# EAGLE design 701_breakout_serial (EAGLE 7.4.0)
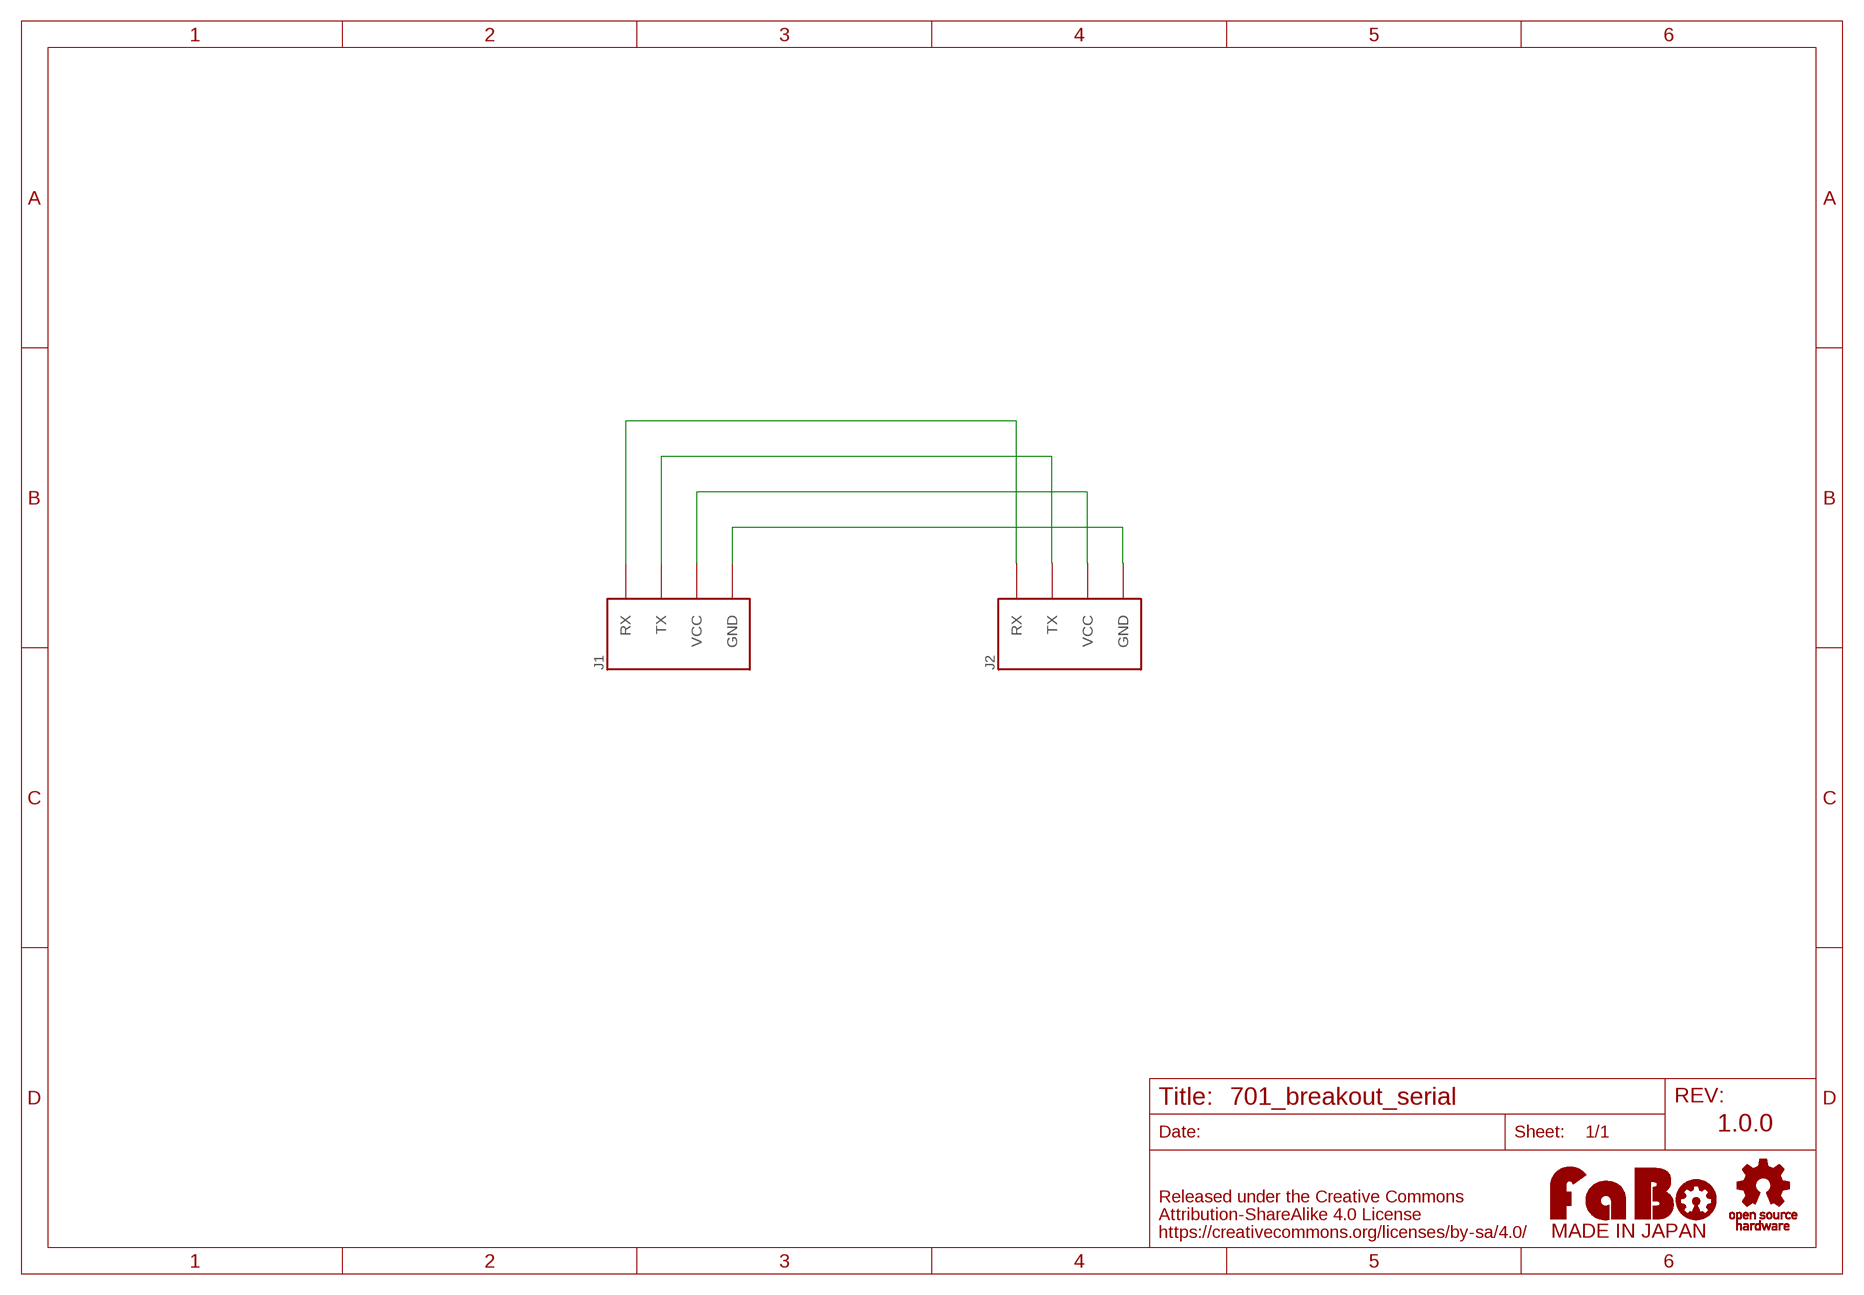
[diagram p0: schematic, sheet 1]

## Parts
J1  FABO_BRICK_SERIAL-BREAKOUT  [FABO_BRICK_SERIAL_BREAKOUT]
J2  FABO_BRICK_SERIAL-CONNECTOR  [FABO_BRICK_SERIAL_CONNECTOR]
U$2  LOGO_FABO-M_BOTTOM  [LOGO_FABO_M_BOTTOM]
U$3  LOGO_OSHW-T_M_BOTTOM  [LOGO_OSHW_T_M_BOTTOM]

## Nets
GND: J1.GND J2.GND
SCL: J1.RX J2.RX
SDA: J1.TX J2.TX
VCC: J1.VCC J2.VCC

## Notes on the sheet
- 1.0.0

## Library data of the parts
J1 J2 = FaBo-Template:FABO_BRICK_SERIAL: FaBo Brick Serial
U$2 = FaBo-etc:LOGO_FABO
U$3 = FaBo-etc:LOGO_OSHW

## Board
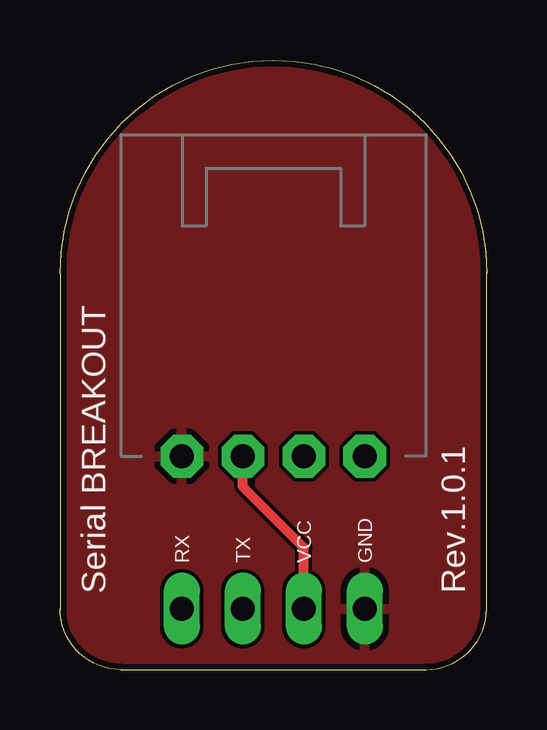
[diagram p1: board, top side]
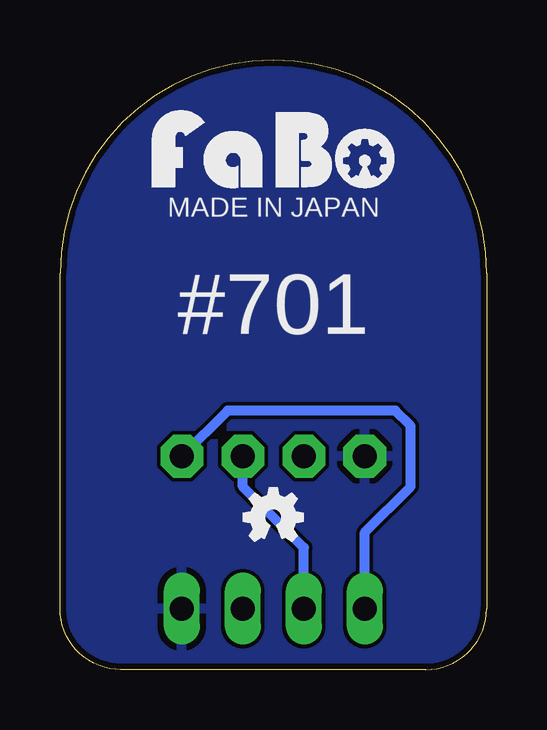
[diagram p2: board, bottom side, seen from below]

Size 17.78 x 25.4 mm. Coordinates in mm from the lower left corner, seen from the top.
Copper layers (1*16): Top 0.035mm / dielectric 1.5mm / Bottom 0.035mm
Design rules "Elecrow_2-layer_eagle_rule": minimum track width 6mil, minimum drill 12mil, track to track 6mil, track to pad 6mil, pad to pad 6mil, via to via 6mil, smd to smd 0mil, copper to edge 10mil, drill to drill 10mil, minimum pad ring 10mil, minimum via ring 6mil, stop-mask expansion 2mil, vias tented up to drill 100mil, thermal gap 10mil

### Footprints (pad centres in the part's own frame; a part is rotated, then mirrored left to right if it is on the bottom)
FABO_BRICK_SERIAL_BREAKOUT = drill 1 long: GND 3.81,-10.16; RX -3.81,-10.16; TX -1.27,-10.16; VCC 1.27,-10.16
FABO_BRICK_SERIAL_CONNECTOR = drill 1 pad 1.778 octagon: GND -3.81,0; RX 3.81,0; TX 1.27,0; VCC -1.27,0

### Placement (x,y rotation side)
J1  8.89,12.7 0 top
J2  8.89,8.89 0 top
U$2  [LOGO_FABO_MS_BOTTOM]  8.89,19.68 0 top
U$3  [LOGO_OSHW_S_BOTTOM]  8.89,6.35 0 top

### Tracks (layer width: path | path; a pad name or v marks a point on that pad's centre or on a via)
GND
  pour Bottom: -1.27,-1.27 19.05,-1.27 19.05,26.67 -1.27,26.67
  pour Top: -1.27,-1.27 19.05,-1.27 19.05,26.67 -1.27,26.67
SCL
  Bottom 0.406: J1.RX 5.08,5.71 3.17,7.62 3.17,10.16 3.81,10.79 10.79,10.79 J2.RX
SDA
  Bottom 0.406: J1.TX 7.62,5.08 10.16,7.62 J2.TX
VCC
  Top 0.406: J1.VCC 10.16,5.08 7.62,7.62 J2.VCC

### Text on the board
tPlace: Serial BREAKOUT | Rev.1.0.1
bPlace: MADE IN JAPAN | #701